# EAGLE design BSK4 (EAGLE 9.4.2)
ESKD_DESCRIPTION1: 207|235|224|242|224|32|193|209|202|52; ESKD_DESCRIPTION2: 241|245|229|236|224|32|253|235|229|234|242|240|232|247|229|241|234|224|255; ESKD_DESCRIPTION3: 239|240|232|237|246|232|239|232|224|235|252|237|224|255; ESKD_NUMBER: 67|67|83|49|46|50|53|48|48|45|48|221|51; ESKD_NUMBER_SHEET: 49; ESKD_SHEETS: 49
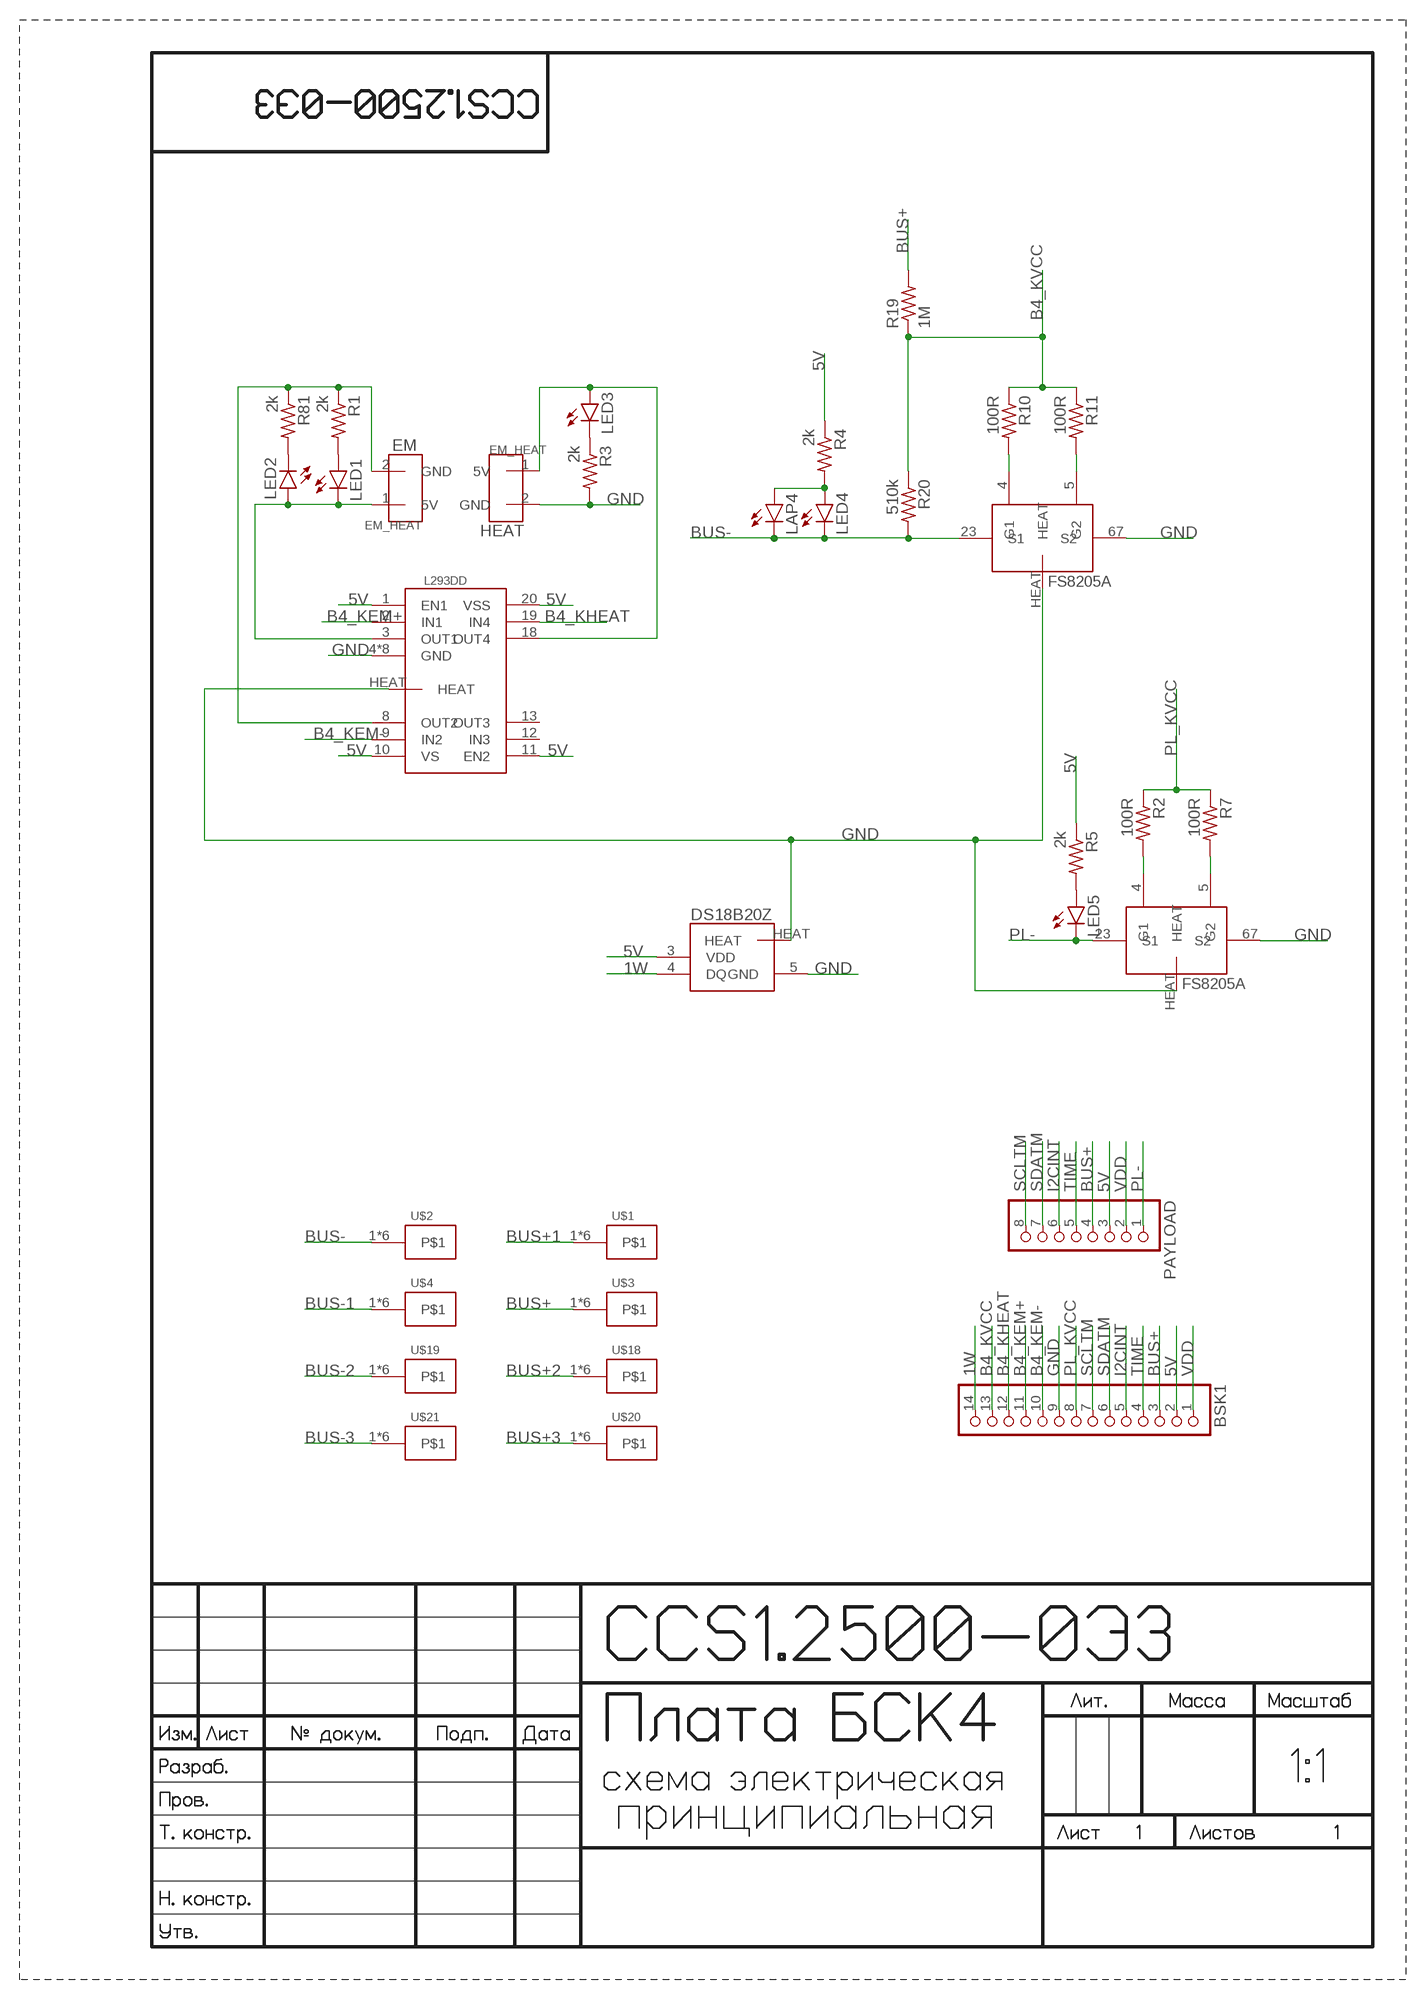
[diagram p0: schematic, sheet 1]

## Parts
BSK1  PINHD-1X14  [1X14]
DS18B20Z  DS18B20Z  [DS18B20Z]
FS8205A#1  FS8205A+  [FS8205A+]
FS8205A#2  FS8205A+  [FS8205A+]
L293DD  L293DD  [L293DD]
LAP4  LAP4-BOTTOM  [P47F-BOTTOM]
LED1  LEDCHIPLED_0603  [CHIPLED_0603]
LED2  LEDCHIPLED_0603  [CHIPLED_0603]
LED3  LEDCHIPLED_0603  [CHIPLED_0603]
LED4  LEDCHIPLED_0603  [CHIPLED_0603]
LED5  LEDCHIPLED_0603  [CHIPLED_0603]
PAYLOAD  PINHD-1X8  [1X08]
R1  2k  R-US_R0603  [R0603]
R2  100R  R-US_R0603  [R0603]
R3  2k  R-US_R0603  [R0603]
R4  2k  R-US_R0603  [R0603]
R5  2k  R-US_R0603  [R0603]
R7  100R  R-US_R0603  [R0603]
R10  100R  R-US_R0603  [R0603]
R11  100R  R-US_R0603  [R0603]
R19  1M  R-US_R0603  [R0603]
R20  510k  R-US_R0603  [R0603]
R81  2k  R-US_R0603  [R0603]
U$1  KCONNECT  [KCONNECT]
U$2  KCONNECT  [KCONNECT]
U$3  KCONNECT  [KCONNECT]
U$4  KCONNECT  [KCONNECT]
U$6  EM_HEAT  [EM_HEAT]
U$7  EM_HEAT  [EM_HEAT]
U$18  KCONNECT  [KCONNECT]
U$19  KCONNECT  [KCONNECT]
U$20  KCONNECT  [KCONNECT]
U$21  KCONNECT  [KCONNECT]

## Nets
1W: BSK1.14 DS18B20Z.4(DQ)
5V: BSK1.2 DS18B20Z.3(VDD) L293DD.1(EN1) L293DD.10(VS) L293DD.11(EN2) L293DD.20(VSS) PAYLOAD.3 R4.1 R5.1
B4_KEM+: BSK1.11 L293DD.2(IN1)
B4_KEM-: BSK1.10 L293DD.9(IN2)
B4_KHEAT: BSK1.12 L293DD.19(IN4)
B4_KVCC: BSK1.13 R10.1 R11.1 R19.1 R20.1
BUS+: BSK1.3 PAYLOAD.4 R19.2 U$3.1 U$3.2 U$3.3 U$3.4 U$3.P$1 U$3.P$2
BUS+1: U$1.1 U$1.2 U$1.3 U$1.4 U$1.P$1 U$1.P$2
BUS+2: U$18.1 U$18.2 U$18.3 U$18.4 U$18.P$1 U$18.P$2
BUS+3: U$20.1 U$20.2 U$20.3 U$20.4 U$20.P$1 U$20.P$2
BUS-: FS8205A#1.23(S1) LAP4.C LED4.C R20.2 U$2.1 U$2.2 U$2.3 U$2.4 U$2.P$1 U$2.P$2
BUS-1: U$4.1 U$4.2 U$4.3 U$4.4 U$4.P$1 U$4.P$2
BUS-2: U$19.1 U$19.2 U$19.3 U$19.4 U$19.P$1 U$19.P$2
BUS-3: U$21.1 U$21.2 U$21.3 U$21.4 U$21.P$1 U$21.P$2
GND: BSK1.9 DS18B20Z.5(GND) DS18B20Z.HEAT FS8205A#1.67(S2) FS8205A#1.HEAT FS8205A#2.67(S2) FS8205A#2.HEAT L293DD.4(GND) L293DD.5(GND) L293DD.6(GND) L293DD.7(GND) L293DD.14(GND) L293DD.15(GND) L293DD.16(GND) L293DD.17(GND) L293DD.HEAT R3.2 U$7.2(GND)
I2CINT: BSK1.5 PAYLOAD.6
N$1: L293DD.3(OUT1) LED1.C LED2.A U$6.1(5V)
N$2: L293DD.8(OUT2) R1.1 R81.1 U$6.2(GND)
N$3: L293DD.18(OUT4) LED3.A U$7.1(5V)
N$4: FS8205A#2.4(G1) R2.2
N$5: LED2.C R81.2
N$6: FS8205A#2.5(G2) R7.2
N$7: LED1.A R1.2
N$8: FS8205A#1.4(G1) R10.2
N$9: FS8205A#1.5(G2) R11.2
N$10: LED3.C R3.1
N$27: LAP4.A LED4.A R4.2
N$28: LED5.A R5.2
PL-: FS8205A#2.23(S1) LED5.C PAYLOAD.1
PL_KVCC: BSK1.8 R2.1 R7.1
SCLTM: BSK1.7 PAYLOAD.8
SDATM: BSK1.6 PAYLOAD.7
TIME: BSK1.4 PAYLOAD.5
VDD: BSK1.1 PAYLOAD.2
Unconnected: L293DD.12(IN3) L293DD.13(OUT3)

## Notes on the sheet
- EM
- HEAT

## Library data of the parts
BSK1 = pinheadCS:PINHD-1X14: PIN HEADER
DS18B20Z = CanCubeSat:DS18B20Z
FS8205A#1 FS8205A#2 = CanCubeSat:FS8205A+
L293DD = CanCubeSat:L293DD
LAP4 = led:*P4: PointLED® Enhanced Thinfilm LED TOP & BOTTOM mount LS P47F, LR P47F, LA P47F, LY P47F, LT P4SG, LB P4SG, LW P4SG Source: http://catalog.osram-os.com .. LA_LR_LS_LY_P47F_Pb_free.pdf
LED1-LED5 = led:LED: LED OSRAM: - CHIPLED LG R971, LG N971, LY N971, LG Q971, LY Q971, LO R971, LY R971 LH N974, LH R974 LS Q976, LO Q976, LY Q976 LO Q996 - Hyper CHIPLED LW Q18S LB Q993, LB Q99A, LB R99A - SideLED LS A670, LO A670, LY A670, LG A670, LP A670 LB A673, LV A673, LT A673, LW A673 LH A674 LY A675 LS A676, LA A676, LO A676, LY A676, LW A676 LS A679, LY A679, LG A679 - Hyper Micro SIDELED® LS Y876, LA Y876, LO Y876, LY Y876 LT Y87S - SmartLED LW L88C, LW L88S LB L89C, LB L89S, LG L890 LS L89K, LO L89K, LY L89K LS L896, LA L896, LO L896, LY L896 - TOPLED LS T670, LO T670, LY T670, LG T670, LP T670 LSG T670, LSP T670, LSY T670, LOP T670, LYG T670 LG T671, LOG T671, LSG T671 LB T673, LV T673, LT T673, LW T673 LH T674 LS T676, LA T676, LO T676, LY T676, LB T676, LH T676, LSB T676, LW T676 LB T67C, LV T67C, LT T67C, LS T67K, LO T67K, LY T67K, LW E67C LS E67B, LA E67B, LO E67B, LY E67B, LB E67C, LV E67C, LT E67C LW T67C LS T679, LY T679, LG T679 LS T770, LO T770, LY T770, LG T770, LP T770 LB T773, LV T773, LT T773, LW T773 LH T774 LS E675, LA E675, LY E675, LS T675 LS T776, LA T776, LO T776, LY T776, LB T776 LHGB T686 LT T68C, LB T68C - Hyper Mini TOPLED® LB M676 - Mini TOPLED Santana® LG M470 LS M47K, LO M47K, LY M47K Source: http://www.osram.convergy.de LUXEON: - LUMILED® LXK2-PW12-R00, LXK2-PW12-S00, LXK2-PW14-U00, LXK2-PW14-V00 LXK2-PM12-R00, LXK2-PM12-S00, LXK2-PM14-U00 LXK2-PE12-Q00, LXK2-PE12-R00, LXK2-PE12-S00, LXK2-PE14-T00, LXK2-PE14-U00 LXK2-PB12-K00, LXK2-PB12-L00, LXK2-PB12-M00, LXK2-PB14-N00, LXK2-PB14-P00, LXK2-PB14-Q00 LXK2-PR12-L00, LXK2-PR12-M00, LXK2-PR14-Q00, LXK2-PR14-R00 LXK2-PD12-Q00, LXK2-PD12-R00, LXK2-PD12-S00 LXK2-PH12-R00, LXK2-PH12-S00 LXK2-PL12-P00, LXK2-PL12-Q00, LXK2-PL12-R00 Source: www.luxeon.com KINGBRIGHT: KA-3528ASYC Source: www.kingbright.com
PAYLOAD = pinheadCS:PINHD-1X8: PIN HEADER
R1-R5 R7 R10 R11 R19 R20 R81 = resistor:R-US_: RESISTOR, American symbol
U$1-U$4 U$18-U$21 = CanCubeSat:KCONNECT
U$6 U$7 = CanCubeSat:EM_HEAT

## Board
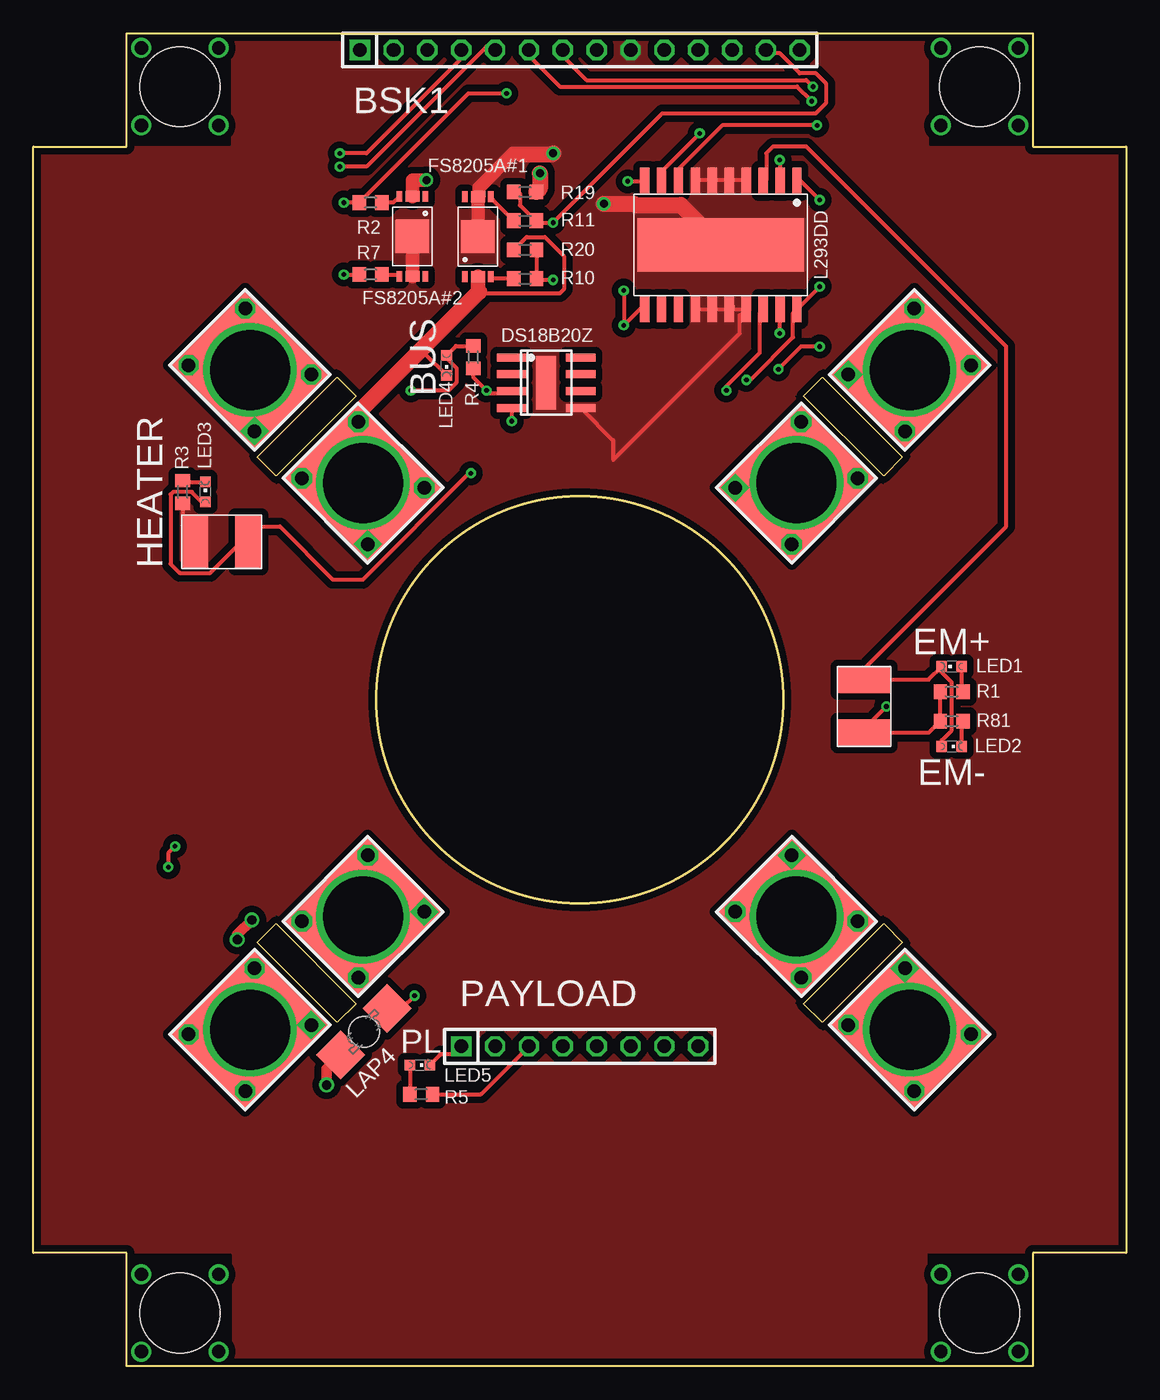
[diagram p1: board, top side]
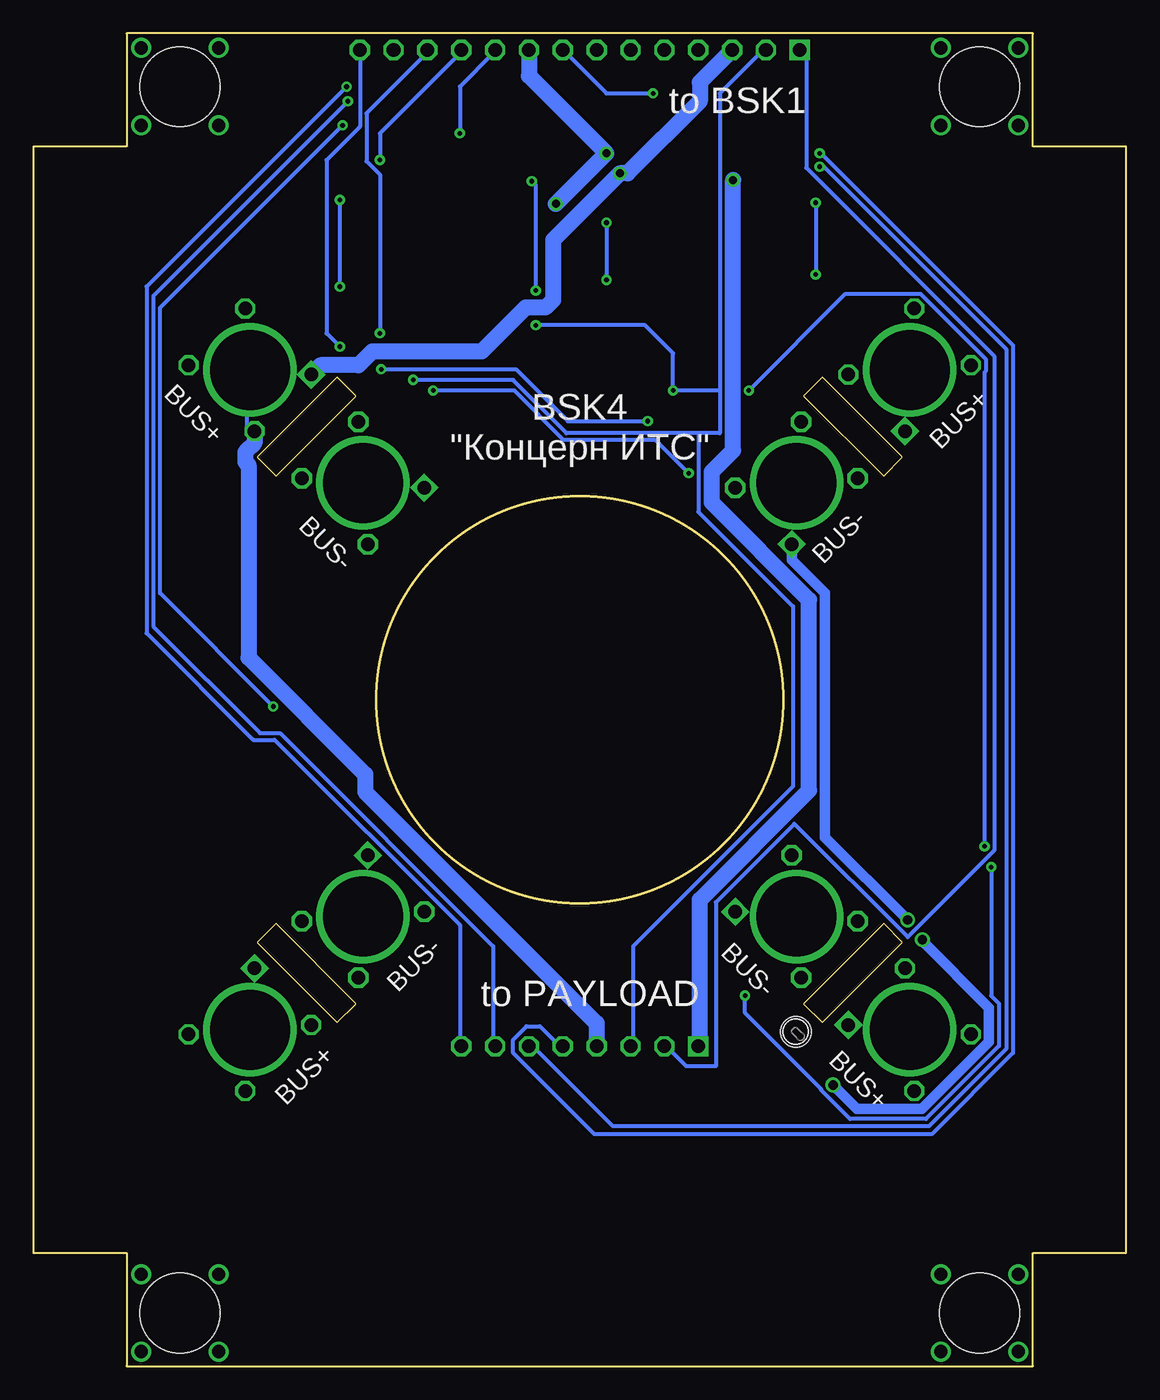
[diagram p2: board, bottom side, seen from below]

Size 82 x 100 mm. Coordinates in mm from the lower left corner, seen from the top.
Outline: 0,8.5 0,91.5 7,91.5 7,100 75,100 75,91.5 82,91.5 82,8.5 75,8.5 75,0 7,0 7,8.5 0,8.5
Outline: 57.79,27.2 63.8,33.21 65.22,31.79 59.21,25.78 57.79,27.2
Outline: 16.78,68.21 22.79,74.22 24.21,72.8 18.2,66.79 16.78,68.21
Outline: 63.8,66.79 57.79,72.8 59.21,74.22 65.22,68.21 63.8,66.79
Outline: 22.79,25.78 16.78,31.79 18.2,33.21 24.21,27.2 22.79,25.78
Outline: circle at 41,50 radius 15.25
Copper layers (1*16): Top 0.035mm / dielectric 1.5mm / Bottom 0.035mm
Design rules "default *": minimum track width 0.3mm, minimum drill 0.35mm, track to track 0.2mm, track to pad 0.2mm, pad to pad 0.2mm, via to via 0.2mm, smd to smd 0.2mm, copper to edge 0.25mm, drill to drill 6mil, minimum pad ring 10mil, minimum via ring 8mil, stop-mask expansion 2mil, vias tented up to drill 0mil, thermal gap 10mil
Holes 6 mm at 11,4 71,4 71,96 11,96

### Footprints (pad centres in the part's own frame; a part is rotated, then mirrored left to right if it is on the bottom)
1X14 = drill 1.016 square: 1 -16.51,0 | drill 1.016 octagon: 2 -13.97,0; 3 -11.43,0; 4 -8.89,0; 5 -6.35,0; 6 -3.81,0; 7 -1.27,0; 8 1.27,0; 9 3.81,0; 10 6.35,0; 11 8.89,0; 12 11.43,0; 13 13.97,0; 14 16.51,0
DS18B20Z = smd 0.6 x 2.2: 1 -1.905,-2.6; 2 -0.635,-2.6; 3 0.635,-2.6; 4 1.905,-2.6; 5 1.905,2.6; 6 0.635,2.6; 7 -0.635,2.6; 8 -1.905,2.6 | smd 4 x 1.5: HEAT 0,0
FS8205A+ = smd 0.4 x 0.8: 1 -0.975,-3; 4 0.975,-3; 5 0.975,3; 8 -0.975,3 | smd 1.05 x 0.8: 23 0,-3; 67 0,3 | smd 2.5 x 2.5: HEAT 0,0
L293DD = smd 0.7 x 2: 1 -5.715,-4.8; 2 -4.445,-4.8; 3 -3.175,-4.8; 4 -1.905,-4.8; 5 -0.635,-4.8; 6 0.635,-4.8; 7 1.905,-4.8; 8 3.175,-4.8; 9 4.445,-4.8; 10 5.715,-4.8; 11 5.715,4.8; 12 4.445,4.8; 13 3.175,4.8; 14 1.905,4.8; 15 0.635,4.8; 16 -0.635,4.8; 17 -1.905,4.8; 18 -3.175,4.8; 19 -4.445,4.8; 20 -5.715,4.8 | smd 12.5 x 4: HEAT 0,0
P47F-BOTTOM = smd 2.6 x 2.6: A -2.45,0; C 2.45,0 | hole 2.3: 0,0
CHIPLED_0603 = smd 0.8 x 0.8: A 0,-0.75; C 0,0.75
1X08 = drill 1.016 square: 1 -8.89,0 | drill 1.016 octagon: 2 -6.35,0; 3 -3.81,0; 4 -1.27,0; 5 1.27,0; 6 3.81,0; 7 6.35,0; 8 8.89,0
R0603 = smd 1 x 1.1: 1 -0.85,0; 2 0.85,0
KCONNECT = drill 1.016 square: 1 -3,-3.5 | drill 1.016 octagon: 2 -3,3.5; 3 3,-3.5; 4 3,3.5 | drill 6: P$1 0,0 | smd 8 x 9: P$2 0,0
EM_HEAT = smd 2 x 4: 1 -2,0; 2 2,0

### Placement (x,y rotation side)
BSK1  41,98.75 0 top
DS18B20Z  38.48,73.78 270 top
FS8205A#1  33.36,84.74 0 top
FS8205A#2  28.44,84.76 180 top
L293DD  51.58,84.12 180 top
LAP4  24.8,25.1 225 top
LED1  68.9,52.5 90 top
LED2  68.9,46.5 270 top
LED3  12.9,65.6 0 top
LED4  31,75.1 180 top
LED5  29,22.6 270 top
PAYLOAD  41,24 0 top
R1  68.9,50.6 0 top
R2  25.3,87.3 0 top
R3  11.2,65.6 270 top
R4  33,75.7 90 top
R5  29.1,20.4 180 top
R7  25.3,81.9 0 top
R10  36.9,81.59 180 top
R11  36.89,85.94 180 top
R19  36.89,88.1 0 top
R20  36.9,83.76 180 top
R81  68.9,48.4 0 top
U$1  16.25,74.75 45 top
U$2  24.74,66.26 45 top
U$3  65.75,74.75 315 top
U$4  57.26,66.26 315 top
U$6  62.34,49.51 270 top
U$7  14.13,61.86 180 top
U$18  16.25,25.25 135 top
U$19  24.74,33.74 135 top
U$20  65.75,25.25 225 top
U$21  57.26,33.74 225 top

### Tracks (layer width: path | path; a pad name or v marks a point on that pad's centre or on a via)
1W  (via drill 0.35)
  Top 0.3: v35.9,70.9 35.9,71.9 DS18B20Z.4 | v59,76.5 57.6,76.5 v55.9,74.8
  Bottom 0.3: v35.9,70.9 41.9,70.9 45.8,74.8 v55.9,74.8 | v59,76.5 60,77.5 60,90.5 57.5,93 57.5,98.5 BSK1.14
5V  (via drill 0.35)
  Top 0.3: DS18B20Z.3 35.5,73 34.2,73 v34,73.2 33,74.2 R4.1 | v59,81 57.5,79.5 L293DD.20 57,79 57,77.2 53.8,74 v53.5,74 | v59,87.5 57.5,89 L293DD.1 | v44.6,88.9 45.84,88.9 L293DD.10 | L293DD.11 45.52,79.32 v44.3,78.1 v44.3,80.7 | R5.1 33.59,20.4 PAYLOAD.3
  Bottom 0.3: 30.5,73.2 30.5,95.5 27.5,98.5 BSK1.2 | 30.5,73.2 30.5,70 32.1,70 | 32.1,70 32.1,64.1 25,57 25,43.5 37,31.5 37,24 PAYLOAD.3 | v53.5,74 46,74 42,70 32.1,70 | 30.5,73.2 v34,73.2 34,76 36.1,78.1 v44.3,78.1 | v44.3,80.7 44.3,88.6 v44.6,88.9 | v59,81 v59,87.5
B4_KEM+  (via drill 0.35)
  Top 0.3: v56,90.5 56,89 L293DD.2
  Bottom 0.3: v56,90.5 56,92.5 50,98.5 BSK1.11
B4_KEM-  (via drill 0.35)
  Top 0.3: v50,92.5 47,89.5 47,89 L293DD.9
  Bottom 0.3: v50,92.5 50,96 47.5,98.5 BSK1.10
B4_KHEAT  (via drill 0.35)
  Top 0.3: v56,77.5 56,79 L293DD.19
  Bottom 0.3: v56,77.5 56,89.4 57,90.4 57,94 52.5,98.5 BSK1.12
B4_KVCC  (via drill 0.35)
  Top 0.3: 37.63,85.97 36.5,87.1 36.5,88 R19.1 | 37.63,85.97 37.5,86 37.7,85.8 v39,85.8 47.2,94 58.7,94 59.5,94.8 59.5,96.2 58.7,97 57.5,97 56,98.5 55,98.5 BSK1.13 | 37.63,85.97 R11.1 | v39,81.5 38,81.5 R10.1 R20.1
  Bottom 0.3: v39,85.8 v39,81.5
BUS+  (via drill 0.6)
  Top 0.3: U$3.1 61.5,74.5 65.5,74.5 U$3.P$2 66,75 | 66,75 70,75 U$3.4 | 66,75 66,79 U$3.2
  Top 1.2: v38,89.5 38,88.36 R19.2
  Bottom 0.3: U$3.P$2 66,74.5 66,70 65.5,70 U$3.3
  Bottom 1.2: BSK1.3 32,96.32 32,94.9 37.4,89.5 v38,89.5 43,84.5 43,80 43.57,79.43 45.07,79.43 48.37,76.13 56.57,76.13 57.6,75.09 60.45,75.09 U$3.1 | U$3.3 65.4,69.27 66.09,68.57 66.09,67.85 65.86,67.61 65.86,53.16 57.1,44.4 57.1,43.1 39.73,25.73 PAYLOAD.4
BUS+1
  Top 0.3: 16,75 12,75 U$1.2 | 16.5,74.5 16.5,70.5 U$1.1 | 16,75 16,79 U$1.4 | 16.5,74.5 20.5,74.5 U$1.3 | 16.5,74.5 U$1.P$2 16,75
BUS+2
  Top 0.3: 16,25 12,25 U$18.4 | 16,25 16,21 U$18.2 | 16,25 U$18.P$2 16.5,25.5 | 16.5,25.5 16.5,29.5 U$18.3 | 16.5,25.5 20.5,25.5 U$18.1
BUS+3
  Top 0.3: 66,25 66,21 U$20.4 | 65.5,25.5 61.5,25.5 U$20.3 | 66,25 70,25 U$20.2 | 66,25 U$20.P$2 65.5,25.5 | 65.5,25.5 65.5,29.5 U$20.1
BUS-  (via drill 0.7)
  Top 0.3: 25,66 29,66 U$2.3 | U$2.2 20.5,66.5 24.5,66.5 U$2.P$2 | U$2.4 24.5,70.5 U$2.P$2 | 25,66 25,62 U$2.1 | 25,66 U$2.P$2 | R20.2 36.07,83.76 37.02,84.71 38.38,84.71 39.8,83.29 39.8,80.8 39.5,80.5 33.57,80.5 33.46,80.61 33.36,80.71 | 29.37,76.53 29.37,75.98 LED4.C
  Top 0.8: v16.4,33.48 15.3,32.38 v15.3,32 | v22,21.1 22,22.3 LAP4.C
  Top 1: 24.39,71.54 U$2.4
  Top 1.1: 33.36,80.71 FS8205A#1.23
  Top 1.2: 33.46,80.61 29.37,76.53 24.39,71.54
  Bottom 0.8: U$2.1 25.09,60.49 22.6,58 22.6,39.68 v16.4,33.48 | v15.3,32 15.3,31.9 10.29,26.89 10.29,24.33 15.33,19.29 20.19,19.29 v22,21.1
BUS-1
  Top 0.3: 57,66 53,66 U$4.1 | 57,66 57,62 U$4.3 | 57,66 U$4.P$2 57.5,66.5 | 57.5,66.5 57.5,70.5 U$4.2 | 57.5,66.5 61.5,66.5 U$4.4
BUS-2
  Top 0.3: 24.5,33.5 20.5,33.5 U$19.4 | 24.5,33.5 24.5,29.5 U$19.2 | 24.5,33.5 U$19.P$2 25,34 | 25,34 25,38 U$19.3 | 25,34 29,34 U$19.1
BUS-3
  Top 0.3: 57.5,33.5 57.5,29.5 U$21.4 | 57,34 53,34 U$21.3 | 57.5,33.5 61.5,33.5 U$21.2 | 57.5,33.5 U$21.P$2 57,34 | 57,34 57,38 U$21.1
GND  (via drill 0.6)
  Top 0.3: 51,89 50,89 L293DD.7 | L293DD.4 53.5,89 52.5,89 L293DD.5 52,89 51,89 | 51,89 L293DD.6 | L293DD.16 52.5,79.5 52,79.5 L293DD.16 | U$7.2 12.32,61.93 11.2,63.06 R3.2 | L293DD.16 L293DD.17 53,78.83 53,77.5 43.5,68 43.5,69.45 DS18B20Z.5 | L293DD.16 L293DD.15 L293DD.14
  Top 1: v39,91 36.01,91 33.44,88.43 33.44,87.81 FS8205A#1.67 FS8205A#1.HEAT | FS8205A#2.67 FS8205A#2.HEAT
  Top 1.2: v39,91 38.9,90.9 36.66,90.9 | v42.8,87.2 45.1,87.2 45.18,87.12 48.58,87.12 L293DD.HEAT
  Bottom 1.2: BSK1.9 44.81,96.81 v39,91 v42.8,87.2
  cutout Top: 16.25,68.25 18.25,66.25 24.75,72.75 22.75,74.75
  pour Top (isolate 0.5, no thermals): 0,91.5 14.9,91.5 14.9,100 67.1,100 67.1,91.5 82,91.5 82,8.5 67,8.5 67,0 15,0 15,8.4 14.9,8.5 0,8.5
HEAT1
  cutout Top: 57.25,27.25 59.25,25.25 65.75,31.75 63.75,33.75
HEAT2
  cutout Top: 63.75,66.25 65.75,68.25 59.25,74.75 57.25,72.75
HEAT3
  cutout Top: 22.75,25.25 24.75,27.25 18.25,33.75 16.25,31.75
I2CINT  (via drill 0.35)
  Top 0.3: v23,90 25,90 34,99 34.5,99 BSK1.5
  Bottom 0.3: v23,90 22.7,90 9,76.3 9,23.8 14.8,18 38.5,18 44.5,24 PAYLOAD.6
N$1
  Top 0.3: L293DD.3 55,89 55,91 55.5,91.5 58,91.5 73,76.5 73,63 62,52 U$6.1 67.16,51.51 LED1.C 68.15,52.05 68.9,51.3 68.9,47.7 68.15,46.95 LED2.A
N$2  (via drill 0.35)
  Top 0.3: v58.8,93.1 51.7,93.1 48.5,89.9 48.5,89 L293DD.8 | v64,49.5 62.34,47.84 U$6.2 67.16,47.51 R81.1 R1.1
  Bottom 0.3: v58.8,93.1 72.5,79.4 72.5,58 v64,49.5
N$3  (via drill 0.35)
  Top 0.3: L293DD.18 54.5,79 54.5,76.03 52,73.53 v52,73.2 | LED3.A 12.64,64.85 11.89,65.6 10.51,65.6 10.3,65.39 10.3,60.2 10.98,59.51 13.28,59.51 15.62,61.86 U$7.1 16,61.99 16,63 18.5,63 22.5,59 24.7,59 32.7,67 v32.83,67
  Bottom 0.3: v32.83,67 35.33,69.5 42.21,69.5 45.91,73.2 v52,73.2
N$4
  Top 0.3: FS8205A#2.4 27,87.3 R2.2
N$5
  Top 0.3: LED2.C 69.65,48.3 R81.2
N$6
  Top 0.3: R7.2 27.32,81.9 FS8205A#2.5
N$7
  Top 0.3: R1.2 69.65,50.7 LED1.A
N$8
  Top 0.3: R10.2 34.48,81.59 FS8205A#1.4
N$9
  Top 0.3: FS8205A#1.5 34.5,87.5 36,86 R11.2
N$10
  Top 0.3: R3.1 11.3,66.35 LED3.C
N$11  (via drill 1)
  other vias: 8.1,6.9
N$12  (via drill 1)
  other vias: 8.1,1.1
N$13  (via drill 1)
  other vias: 13.9,1.1
N$14  (via drill 1)
  other vias: 13.9,6.9
N$15  (via drill 1)
  other vias: 68.1,6.9
N$16  (via drill 1)
  other vias: 68.1,1.1
N$17  (via drill 1)
  other vias: 73.9,1.1
N$18  (via drill 1)
  other vias: 73.9,6.9
N$19  (via drill 1)
  other vias: 68.1,98.9
N$20  (via drill 1)
  other vias: 68.1,93.1
N$21  (via drill 1)
  other vias: 73.9,93.1
N$22  (via drill 1)
  other vias: 73.9,98.9
N$23  (via drill 1)
  other vias: 8.1,98.9
N$24  (via drill 1)
  other vias: 8.1,93.1
N$25  (via drill 1)
  other vias: 13.9,93.1
N$26  (via drill 1)
  other vias: 13.9,98.9
N$27  (via drill 0.35)
  Top 0.3: R4.2 31.7,76.55 LED4.A 31,75.64 31.75,74.89 31.75,73.81 31.14,73.2 v28.32,73.2 | v10.63,39 10.13,38.5 v10.13,37.44 | v28.6,27.8 27.63,26.83 LAP4.A
  Bottom 0.3: v28.32,73.2 21.06,80.46 15.44,80.46 10.54,75.56 10.54,74.64 10.63,74.56 v10.63,39 | v10.13,37.44 10.13,27.79 9.54,27.2 9.54,24.02 15.02,18.54 20.72,18.54 22.9,20.73 22.9,20.8 28.6,26.5 v28.6,27.8
N$28
  Top 0.3: LED5.A R5.2
PL-  (via drill 0.6)
  Top 0.3: LED5.C 30.55,23.4 31.51,23.4 PAYLOAD.1
  Top 1: FS8205A#2.23 28.44,89 v29.5,89
  Bottom 0.3: PAYLOAD.1 32,24
  Bottom 1.2: 32,24 32,35 23.8,43.2 23.8,57.5 31.1,64.8 31.1,67.1 29.5,68.7 v29.5,89
PL_KVCC  (via drill 0.35)
  Top 0.3: v23.3,87.3 R2.1 32.65,95.5 v35.5,95.5 | v23.3,81.9 R7.1
  Bottom 0.3: v35.5,95.5 39,95.5 42,98.5 BSK1.8 | v23.3,87.3 v23.3,81.9
SCLTM  (via drill 0.35)
  Top 0.3: v58.5,96 58,96.5 41.5,96.5 39.5,98.5 BSK1.7
  Bottom 0.3: v58.5,96 73.5,81 73.5,55 65.5,47 63.9,47 50,33.1 50,24 PAYLOAD.8
SDATM  (via drill 0.35)
  Top 0.3: v58.4,94.9 57.3,96 39.5,96 37,98.5 BSK1.6
  Bottom 0.3: v58.4,94.9 73,80.3 73,55.5 65,47.5 63.5,47.5 47.5,31.5 47.5,24 PAYLOAD.7
TIME  (via drill 0.35)
  Top 0.3: v23,91 25,91 32.5,98.5 BSK1.4
  Bottom 0.3: v23,91 22.9,91 8.5,76.6 8.5,23.5 14.6,17.4 39.9,17.4 46,23.5 46,24.5 45,25.5 44,25.5 42.5,24 PAYLOAD.5
VDD
  Bottom 0.3: PAYLOAD.2 34.5,24 33,22.5 30.8,22.5 30.8,34.8 24.9,40.7 16.4,32.2 9.9,38.7 9.9,75.8 24,89.9 24,98.5 BSK1.1

### Text on the board
tPlace: PL
tNames: BUS | HEATER | EM+ | EM-
bNames: to BSK1 | BUS+ | BUS+ | BSK4 / "Концерн ИТС" | BUS- | BUS- | BUS- | BUS- | to PAYLOAD | BUS+ | BUS+